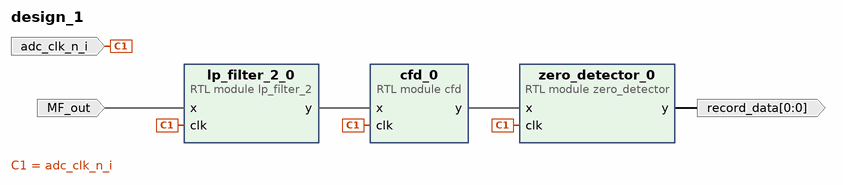
[diagram p0: block diagram of the top level]
# Vivado block design design_1, xc7z010clg400-1, Vivado 2016.3
create_bd_design design_1

create_bd_port -dir I -type clk adc_clk_n_i
set_property -dict {CONFIG.FREQ_HZ 125000000} [get_bd_ports adc_clk_n_i]
create_bd_port -dir I -type data MF_out
create_bd_port -dir O -from 0 -to 0 record_data

create_bd_cell -type module -reference lp_filter_2 lp_filter_2_0
create_bd_cell -type module -reference zero_detector zero_detector_0
create_bd_cell -type module -reference cfd cfd_0

# ---- connections ----

connect_bd_net [get_bd_ports adc_clk_n_i] [get_bd_pins lp_filter_2_0/clk] [get_bd_pins zero_detector_0/clk] [get_bd_pins cfd_0/clk]
connect_bd_net [get_bd_pins lp_filter_2_0/y] [get_bd_pins cfd_0/x]
connect_bd_net [get_bd_pins cfd_0/y] [get_bd_pins zero_detector_0/x]
connect_bd_net [get_bd_ports MF_out] [get_bd_pins lp_filter_2_0/x]
connect_bd_net [get_bd_pins zero_detector_0/y] [get_bd_ports record_data]

validate_bd_design
save_bd_design
